# Altium schematic sheet valveСontrol.SchDoc: Блок управления
size 420 x 297 mm; ApprovedBy: Мешков; CheckedBy: Черноскутов; Author: Самойлов; CompanyName: РГППУ; Title2str: кранами; DecimalNumber: АБВГ.123456.001 33
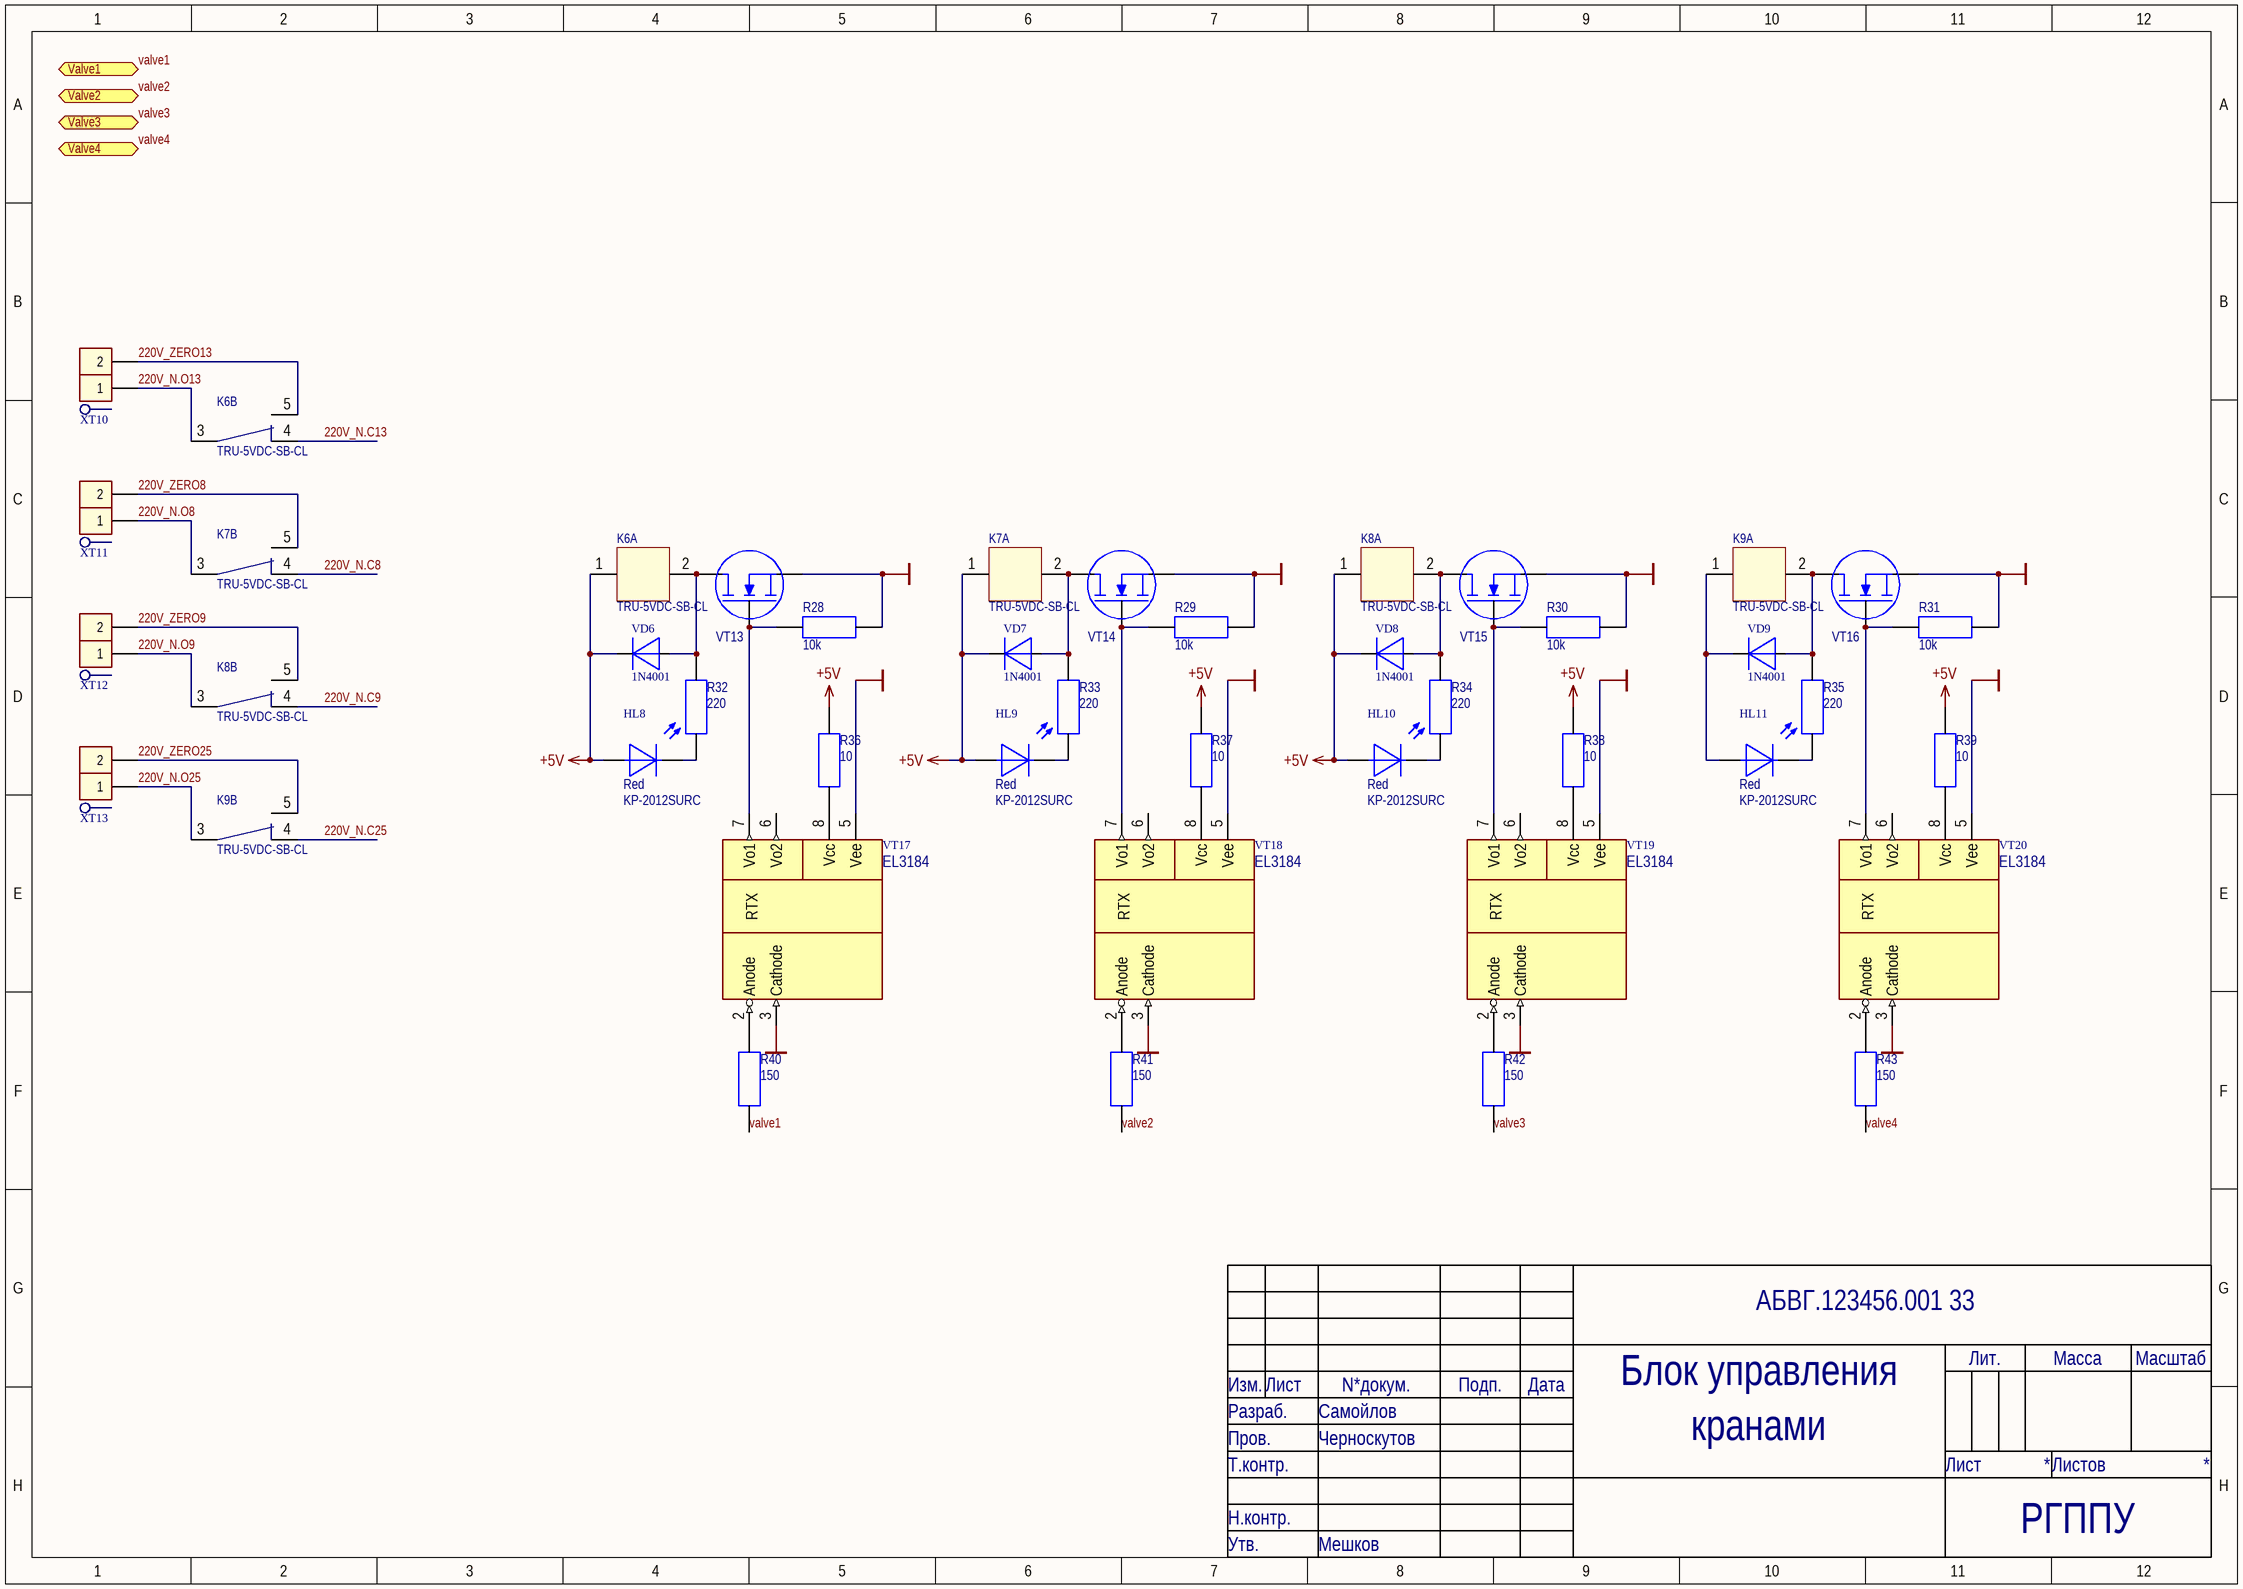
[diagram p0: valveСontrol.SchDoc]

## Parts
HL8  Red  ManufacturerPartNumber: KP-2012SURC  [DIOMELF2012M]
HL9  Red  ManufacturerPartNumber: KP-2012SURC  [DIOMELF2012M]
HL10  Red  ManufacturerPartNumber: KP-2012SURC  [DIOMELF2012M]
HL11  Red  ManufacturerPartNumber: KP-2012SURC  [DIOMELF2012M]
K6  TRU-5VDC-SB-CL  [TRU-5VDC-SB-CL]  (parts A,B of 2)
K7  TRU-5VDC-SB-CL  [TRU-5VDC-SB-CL]  (parts A,B of 2)
K8  TRU-5VDC-SB-CL  [TRU-5VDC-SB-CL]  (parts A,B of 2)
K9  TRU-5VDC-SB-CL  [TRU-5VDC-SB-CL]  (parts A,B of 2)
R28  10k  [SMDRC0805]
R29  10k  [SMDRC0805]
R30  10k  [SMDRC0805]
R31  10k  [SMDRC0805]
R32  220  [SMDRC0805]
R33  220  [SMDRC0805]
R34  220  [SMDRC0805]
R35  220  [SMDRC0805]
R36  10  [SMDRC0805]
R37  10  [SMDRC0805]
R38  10  [SMDRC0805]
R39  10  [SMDRC0805]
R40  150  [SMDRC0805]
R41  150  [SMDRC0805]
R42  150  [SMDRC0805]
R43  150  [SMDRC0805]
VD6  1N4001  [PinDiode]
VD7  1N4001  [PinDiode]
VD8  1N4001  [PinDiode]
VD9  1N4001  [PinDiode]
VT13  2N7002  [SOT23 (TO-236AB)]  (value not drawn)
VT14  2N7002  [SOT23 (TO-236AB)]  (value not drawn)
VT15  2N7002  [SOT23 (TO-236AB)]  (value not drawn)
VT16  2N7002  [SOT23 (TO-236AB)]  (value not drawn)
VT17  EL3184  [DIP8]
VT18  EL3184  [DIP8]
VT19  EL3184  [DIP8]
VT20  EL3184  [DIP8]
XT10  305-021-12  [330-021-12]  (value not drawn)
XT11  305-021-12  [330-021-12]  (value not drawn)
XT12  305-021-12  [330-021-12]  (value not drawn)
XT13  305-021-12  [330-021-12]  (value not drawn)

## Ports
Valve1 (in), Valve2 (in), Valve3 (in), Valve4 (in)

## Nets
+5V: HL8.1 HL9.1 HL10.1 K6.1 K7.1 K8.1 R36.2 R37.2 R38.2 R39.2 VD6.K VD7.K VD8.K
GND: R28.2 R29.2 R30.2 R31.2 VT13.2(S) VT14.2(S) VT15.2(S) VT16.2(S) VT17.3(Cathode) VT17.5(Vee) VT18.3(Cathode) VT18.5(Vee) VT19.3(Cathode) VT19.5(Vee) VT20.3(Cathode) VT20.5(Vee)
220V_N.C8: K7.4
220V_N.C9: K8.4
220V_N.C13: K6.4
220V_N.C25: K9.4
220V_N.O8: K7.3 XT11.1
220V_N.O9: K8.3 XT12.1
220V_N.O13: K6.3 XT10.1
220V_N.O25: K9.3 XT13.1
220V_ZERO8: K7.5 XT11.2
220V_ZERO9: K8.5 XT12.2
220V_ZERO13: K6.5 XT10.2
220V_ZERO25: K9.5 XT13.2
valve1: R40.1 ; port Valve1
valve2: R41.1 ; port Valve2
valve3: R42.1 ; port Valve3
valve4: R43.1 ; port Valve4
NetHL8_2: HL8.2 R32.2
NetHL9_2: HL9.2 R33.2
NetHL10_2: HL10.2 R34.2
NetHL11_1: HL11.1 K9.1 VD9.K
NetHL11_2: HL11.2 R35.2
NetK6_2: K6.2 R32.1 VD6.A VT13.3(D)
NetK7_2: K7.2 R33.1 VD7.A VT14.3(D)
NetK8_2: K8.2 R34.1 VD8.A VT15.3(D)
NetK9_2: K9.2 R35.1 VD9.A VT16.3(D)
NetR28_1: R28.1 VT13.1(G) VT17.7(Vo1)
NetR29_1: R29.1 VT14.1(G) VT18.7(Vo1)
NetR30_1: R30.1 VT15.1(G) VT19.7(Vo1)
NetR31_1: R31.1 VT16.1(G) VT20.7(Vo1)
NetR36_1: R36.1 VT17.8(Vcc)
NetR37_1: R37.1 VT18.8(Vcc)
NetR38_1: R38.1 VT19.8(Vcc)
NetR39_1: R39.1 VT20.8(Vcc)
NetR40_2: R40.2 VT17.2(Anode)
NetR41_2: R41.2 VT18.2(Anode)
NetR42_2: R42.2 VT19.2(Anode)
NetR43_2: R43.2 VT20.2(Anode)

Not connected (* = marked no-connect by the designer): VT17 6(Vo2); VT18 6(Vo2); VT19 6(Vo2); VT20 6(Vo2)

## Notes on the sheet
- Изм.
- Лист
- N*докум.
- Подп.
- Дата
- Лит.
- Масса
- Масштаб
- Разраб.
- Пров.
- Т.контр.
- Лиcт
- Лиcтов
- Н.контр.
- Утв.
- (in symbol EL3184) RTX

## Library data of the parts
HL8-HL11 = LED1_R: Diod LED SMD Red; ComponentLink1Description: Datasheet; Cost: 5,01; ComponentLink2Description: Datasheet-local; ComponentLink2URL: *; Color: Red
R28-R31 = Resistor 0805 10k: Generic resistor; PartNumber: Resistor 0805 10k; Value: 10k; ComponentLink1URL: http://www.mouser.com/ds/2/447/PYu-RC0402_51_RoHS_L_6_r-8721.pdf; ComponentLink1Description: Datasheet; Package: 0805
R32-R35 = Resistor 0805 220: Generic resistor; PartNumber: Resistor 0805 220; Value: 220; ComponentLink1URL: http://www.mouser.com/ds/2/447/PYu-RC0402_51_RoHS_L_6_r-8721.pdf; ComponentLink1Description: Datasheet; Package: 0805
R36-R39 = Resistor 0805 10: Generic resistor; PartNumber: Resistor 0805 10; Value: 10; ComponentLink1URL: http://www.mouser.com/ds/2/447/PYu-RC0402_51_RoHS_L_6_r-8721.pdf; ComponentLink1Description: Datasheet; Package: 0805
R40-R43 = Resistor 0805 150: Generic resistor; PartNumber: Resistor 0805 150; Value: 150; ComponentLink1URL: http://www.mouser.com/ds/2/447/PYu-RC0402_51_RoHS_L_6_r-8721.pdf; ComponentLink1Description: Datasheet; Package: 0805
VD6-VD9 = 1N4001: Rectifying diode; ComponentLink1Description: Datasheet; ComponentLink1URL: http://www.promelec.ru/pdf/1N400x.pdf; Cost: 5; Package: штырьевой; ComponentLink2Description: Datasheet-local; ComponentLink2URL: *; ManufacturerPartNumber: 1N4001
VT13-VT16 = 2N7002 n-MOSFET: 60V, 300mA N-channel Trench MOSFET; ManufacturerPartNumber: 2N7002
VT17-VT20 = EL3184: Optocouple IGBT driver; Manufacturer: Everlight Electronics Co. Ltd; Package: DIP-8; ComponentLink1URL: http://www.promelec.ru/pdf/EL3184-EVLT.pdf; ComponentLink1Description: Datasheet; Cost: 66,38; Supplier: Промэлектроника; ManufacturerPartNumber: EL3184
XT10-XT13 = Con2_D 305-021-12: Demountable connection  2-pin; Manufacturer: Degson Electronics Co., Ltd; ManufacturerPartNumber: 305-021-12; ComponentLink1Description: Datasheet; Cost: 7,45; Supplier: Промэлектроника; ComponentLink2Description: Datasheet-local
K6-K9 = TRU-5VDC-SB-CL: ManufacturerPurtNumber: TRU-5VDC-SB-CL